# Altium schematic sheet PLL.SchDoc
size A4
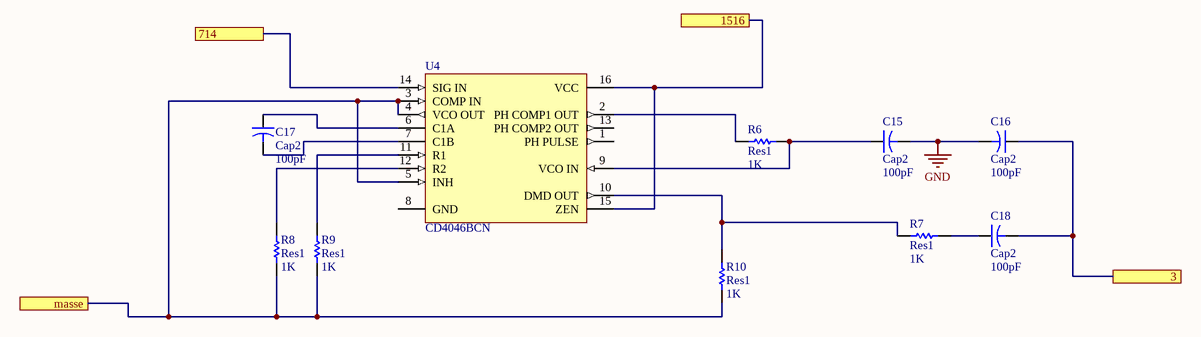
[diagram p0: PLL.SchDoc]

## Parts
C15  Cap2  value 100pF  [RB7.6-15]
C16  Cap2  value 100pF  [RB7.6-15]
C17  Cap2  value 100pF  [RB7.6-15]
C18  Cap2  value 100pF  [RB7.6-15]
R6  Res1  value 1K  [AXIAL-0.3]
R7  Res1  value 1K  [AXIAL-0.3]
R8  Res1  value 1K  [AXIAL-0.3]
R9  Res1  value 1K  [AXIAL-0.3]
R10  Res1  value 1K  [AXIAL-0.3]
U4  CD4046BCN  [N16E]

## Ports
3, 714, 1516, masse

## Nets
GND: C15.2 C16.2
3: C16.1 C18.2 ; port 3
714: U4.14(SIG_IN) ; port 714
1516: U4.15(ZEN) U4.16(VCC) ; port 1516
masse: R8.1 R9.1 R10.1 U4.3(COMP_IN) U4.4(VCO_OUT) U4.5(INH) ; port masse
NetC15_1: C15.1 R6.2 U4.9(VCO_IN)
NetC17_1: C17.1 U4.6(C1A)
NetC17_2: C17.2 U4.7(C1B)
NetC18_1: C18.1 R7.2
NetR6_1: R6.1 U4.2(PH_COMP1_OUT)
NetR7_1: R7.1 R10.2 U4.10(DMD_OUT)
NetR8_2: R8.2 U4.12(R2)
NetR9_2: R9.2 U4.11(R1)

Not connected (* = marked no-connect by the designer): U4 1(PH_PULSE) 8(GND) 13(PH_COMP2_OUT)

## Library data of the parts
C15-C18 = Cap2: Capacitor; Published: 23-Sep-2002; PackageReference: CAPR5-4X5; Publisher: Altium Limited; PackageDescription: Capacitor; 2 Leads
R6-R10 = Res1: Resistor; Published: 8-Jun-2000; LatestRevisionDate: 17-Jul-2002; LatestRevisionNote: Re-released for DXP Platform.; PackageReference: AXIAL-0.3; Publisher: Altium Limited; PackageDescription: Axial Device, Thru-Hole; 2 Leads; 0.3 in Pin Spacing
U4 = CD4046BCN: Micropower Phase-Locked Loop; Published: 17-Jul-2002; LatestRevisionDate: 04-Mar-2005; LatestRevisionNote: Stylized 3D Model Added.; DatasheetVersion: Jan-1999; PackageVersion: 2000; PackageReference: N16E; Publisher: Altium Limited; PackageDescription: DIP, 16-Pin, Row Spacing 7.62 mm, Pitch 2.54 mm; ComponentLink1Description: Manufacturer Link; ComponentLink1URL: http://www.fairchildsemi.com/; ComponentLink2Description: Datasheet; ComponentLink2URL: http://www.fairchildsemi.com/ds/CD%2FCD4046BC.pdf